# EAGLE schematic FNR Controller v1.0 - Relay (EAGLE 6.3)
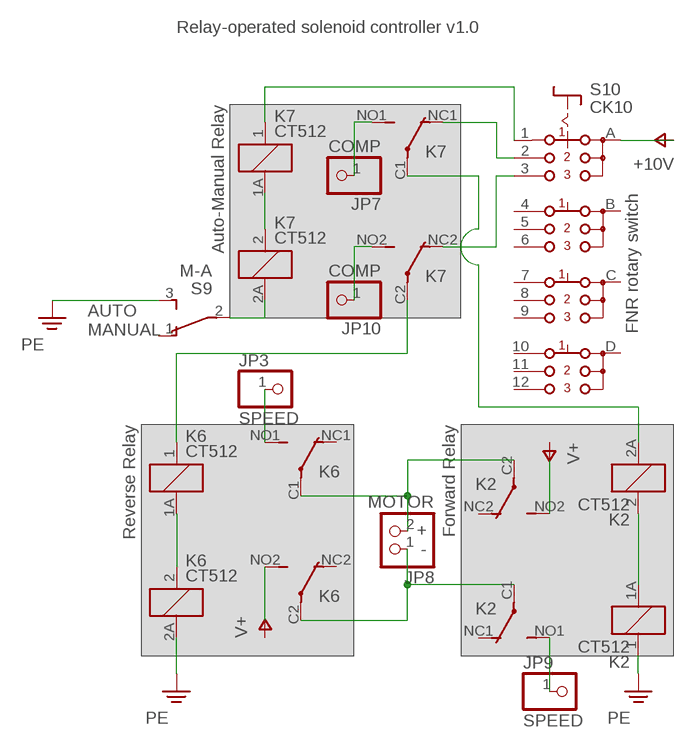
[diagram p0: schematic, sheet 1]

## Parts
JP3  SPEED  PINHD-1X1  [1X01]
JP7  COMP  PINHD-1X1  [1X01]
JP8  MOTOR  PINHD-1X2  [1X02]
JP9  SPEED  PINHD-1X1  [1X01]
JP10  COMP  PINHD-1X1  [1X01]
K2  CT512  [CT2-TWIN]
K6  CT512  [CT2-TWIN]
K7  CT512  [CT2-TWIN]
S9  M-A  TL36PO  [TL3XPO]
S10  CK10  [CK10]

## Nets
N$37: JP8.1 K2.C1(A1:P) K6.C2(B1:P)
N$38: JP8.2 K2.C2(B1:P) K6.C1(A1:P)
N$42: K6.1A K6.2
N$44: K2.1A K2.2
N$46: JP9.1 K2.NO1(A1:S)
N$48: JP3.1 K6.NO1(A1:S)
N$56: K6.NO2(B1:S)
N$57: K2.NO2(B1:S)
N$60: K6.1 K7.C2(B1:P)
N$61: K7.1A K7.2
N$62: K7.2A S9.2(P)
N$63: JP7.1 K7.NO1(A1:S)
N$64: JP10.1 K7.NO2(B1:S)
N$65: K7.1 S10.1(A1)
N$66: K7.NC1(A1:O) S10.2(A2)
N$67: K7.NC2(B1:O) S10.3(A3)
N$68: K2.2A K7.C1(A1:P)
PE: K2.1 K6.2A S9.3(S)
V+: S10.A ; supply symbol labelled +10V
Unconnected: K2.NC1(A1:O) K2.NC2(B1:O) K6.NC1(A1:O) K6.NC2(B1:O) S9.1(O) S10.4(B1) S10.5(B2) S10.6(B3) S10.7(C1) S10.8(C2) S10.9(C3) S10.10(D1) S10.11(D2) S10.12(D3) S10.B S10.C S10.D

## Notes on the sheet
- Relay-operated solenoid controller v1.0
- Auto-Manual Relay
- FNR rotary switch
- AUTO
  MANUAL
- Reverse Relay | Forward Relay
- +
  -

## Library data of the parts
JP3 JP7 JP9 JP10 = adafruit:PINHD-1X1: Pin header 1x1 for 0.1" spacing With round pins
JP8 = pinhead:PINHD-1X2: PIN HEADER
K2 K6 K7 = relay:CT512: ULTRA SMALL AUTOMOTIVE RELAY NAiS Twin type (10 terminals) en_ds_61205_0000.pdf; OC_FARNELL: unknown; OC_NEWARK: unknown
S9 = switch:TL36PO: TINY SWITCH ON - ON Source: http://www2.produktinfo.conrad.com/datenblaetter/700000-724999/705152-da-01-de-Subminiaturschalter_TL_36YO.pdf
S10 = switch:CK10: ROTARY SWITCH C&K